# EAGLE design filter_rev2 (EAGLE 7.4.0)
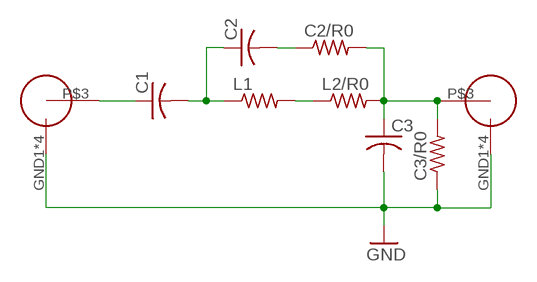
[diagram p0: schematic, sheet 1]

## Parts
C1  C-USC0603  [C0603]
C2  C-USC0603  [C0603]
C2/R0  R-US_R0603  [R0603]
C3  C-USC0603  [C0603]
C3/R0  R-US_R0603  [R0603]
L1  R-US_R0603  [R0603]
L2/R0  R-US_R0603  [R0603]
U$1  SMAJ716-ND  [SMAJ716-ND]
U$2  SMAJ716-ND  [SMAJ716-ND]

## Nets
GND: C3.2 C3/R0.1 U$1.GND1(OUTERCONDUCTOR) U$1.GND2(OUTERCONDUCTOR) U$1.GND3(OUTERCONDUCTOR) U$1.GND4(OUTERCONDUCTOR) U$2.GND1(OUTERCONDUCTOR) U$2.GND2(OUTERCONDUCTOR) U$2.GND3(OUTERCONDUCTOR) U$2.GND4(OUTERCONDUCTOR)
N$1: C1.1 U$1.P$3(CENTERCONDUCTOR)
N$2: C2.2 C2/R0.1
N$5: C1.2 C2.1 L1.1
N$6: C2/R0.2 C3.1 C3/R0.2 L2/R0.2 U$2.P$3(CENTERCONDUCTOR)
N$7: L1.2 L2/R0.1

## Library data of the parts
C1-C3 = adafruit:C-US: CAPACITOR, American symbol
C2/R0 C3/R0 L1 L2/R0 = adafruit:R-US_: RESISTOR, American symbol
U$1 U$2 = SMAJ16-ND:SMAJ716-ND

## Net classes
0 default: width 0.02 mm, drill 0.381 mm, clearance 1.016 mm

## Board
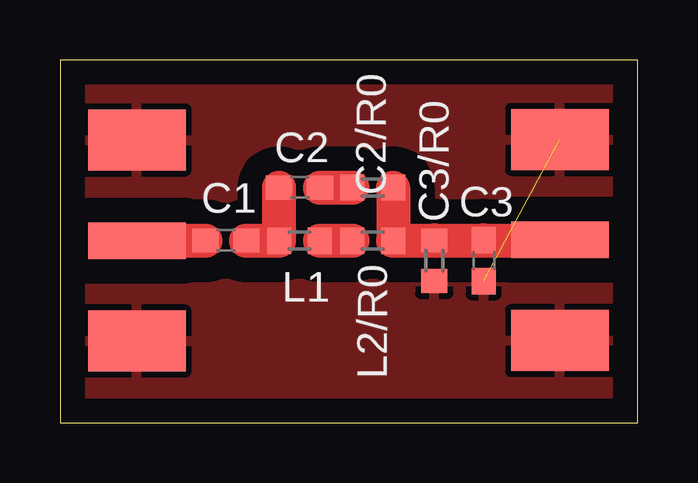
[diagram p1: board, top side]
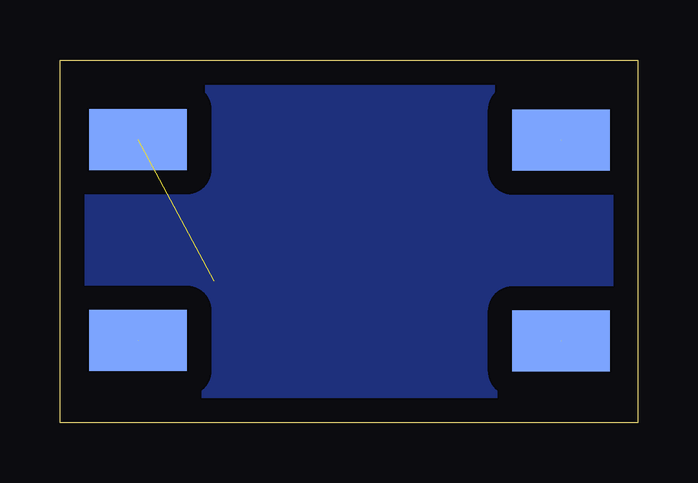
[diagram p2: board, bottom side, seen from below]

Size 24.08 x 15.13 mm. Coordinates in mm from the lower left corner, seen from the top.
Outline: 0,0 24.08,0 24.08,15.13 0,15.13 0,0
Copper layers (1*16): Top 0.035mm / dielectric 1.5mm / Bottom 0.035mm
Design rules "default": minimum track width 10mil, minimum drill 24mil, track to track 8mil, track to pad 8mil, pad to pad 8mil, via to via 8mil, smd to smd 8mil, copper to edge 40mil, drill to drill 8mil, minimum pad ring 10mil, minimum via ring 8mil, stop-mask expansion 4mil, vias tented up to drill 0mil, thermal gap 10mil

### Footprints (pad centres in the part's own frame; a part is rotated, then mirrored left to right if it is on the bottom)
C0603 = smd 1.1 x 1: 1 -0.85,0; 2 0.85,0
R0603 = smd 1 x 1.1: 1 -0.85,0; 2 0.85,0
SMAJ716-ND = smd 2.54 x 4.064 bottom: GND1 4.191,0.508; GND3 -4.191,0.508 | smd 2.54 x 4.064: GND2 -4.191,0.508; GND4 4.191,0.508 | smd 1.524 x 4.064: P$3 0,0.508

### Placement (x,y rotation side)
C1  6.91,7.59 0 top
C2  9.98,9.8 0 top
C2/R0  13.03,9.8 0 top
C3  17.65,6.76 270 top
C3/R0  15.6,6.76 90 top
L1  9.98,7.59 0 top
L2/R0  13.03,7.59 0 top
U$1  3.71,7.59 90 top
U$2  21.34,7.62 90 top

### Tracks (layer width: path | path; a pad name or v marks a point on that pad's centre or on a via)
GND  (5 unrouted)
  pour Top: 0.46,14.83 0.46,0.2 23.55,0.2 23.55,14.81
N$1
  Top 1.422: U$1.P$3 C1.1
N$2
  Top 1.422: C2.2 C2/R0.1
N$3
  pour Bottom: 0.23,0 24.18,-0.05 24.16,15.52 0.15,15.57
N$5
  Top 1.422: C1.2 L1.1 C2.1
N$6
  Top 1.422: 20.73,7.61 U$2.P$3 20.83,7.61 C3.1 C3/R0.2 15.6,7.59 L2/R0.2 C2/R0.2
N$7
  Top 1.422: L1.2 L2/R0.1